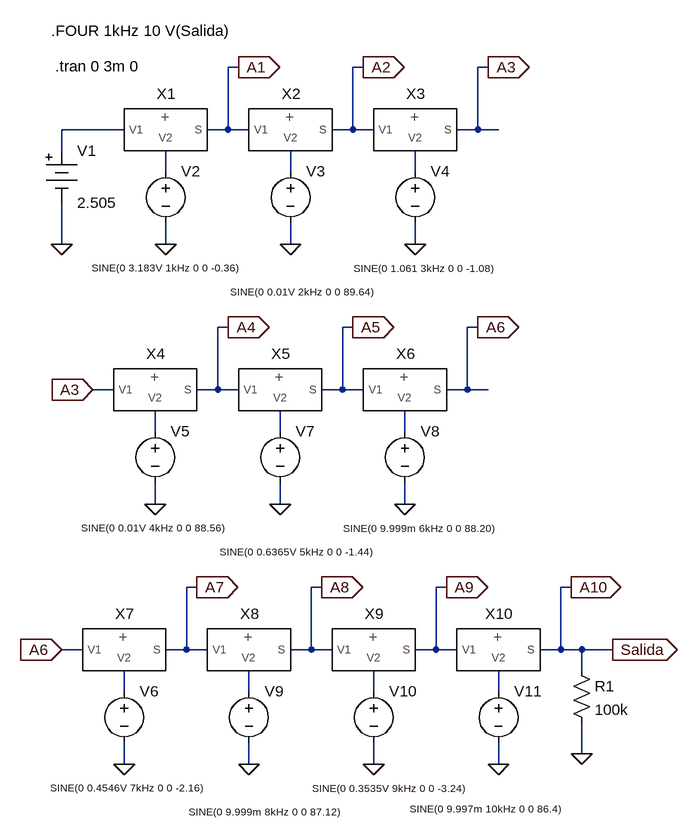
[diagram p0: schematic E5-Reconstruccion.asc]
E5-Reconstruccion.asc, the LTspice schematic file:
Version 4
SHEET 1 1008 680
WIRE -2576 -2576 -2592 -2576
WIRE -2384 -2576 -2400 -2576
WIRE -2192 -2576 -2208 -2576
WIRE -2752 -2480 -2848 -2480
WIRE -2592 -2480 -2592 -2576
WIRE -2592 -2480 -2624 -2480
WIRE -2560 -2480 -2592 -2480
WIRE -2400 -2480 -2400 -2576
WIRE -2400 -2480 -2432 -2480
WIRE -2368 -2480 -2400 -2480
WIRE -2208 -2480 -2208 -2576
WIRE -2208 -2480 -2240 -2480
WIRE -2176 -2480 -2208 -2480
WIRE -2848 -2448 -2848 -2480
WIRE -2688 -2416 -2688 -2448
WIRE -2496 -2416 -2496 -2448
WIRE -2304 -2416 -2304 -2448
WIRE -2848 -2304 -2848 -2368
WIRE -2688 -2304 -2688 -2336
WIRE -2496 -2304 -2496 -2336
WIRE -2304 -2304 -2304 -2336
WIRE -2592 -2176 -2608 -2176
WIRE -2400 -2176 -2416 -2176
WIRE -2208 -2176 -2224 -2176
WIRE -2768 -2080 -2800 -2080
WIRE -2608 -2080 -2608 -2176
WIRE -2608 -2080 -2640 -2080
WIRE -2576 -2080 -2608 -2080
WIRE -2416 -2080 -2416 -2176
WIRE -2416 -2080 -2448 -2080
WIRE -2384 -2080 -2416 -2080
WIRE -2224 -2080 -2224 -2176
WIRE -2224 -2080 -2256 -2080
WIRE -2192 -2080 -2224 -2080
WIRE -2704 -2016 -2704 -2048
WIRE -2512 -2016 -2512 -2048
WIRE -2320 -2016 -2320 -2048
WIRE -2704 -1904 -2704 -1936
WIRE -2512 -1904 -2512 -1936
WIRE -2320 -1904 -2320 -1936
WIRE -2640 -1776 -2656 -1776
WIRE -2448 -1776 -2464 -1776
WIRE -2256 -1776 -2272 -1776
WIRE -2064 -1776 -2080 -1776
WIRE -2816 -1680 -2848 -1680
WIRE -2656 -1680 -2656 -1776
WIRE -2656 -1680 -2688 -1680
WIRE -2624 -1680 -2656 -1680
WIRE -2464 -1680 -2464 -1776
WIRE -2464 -1680 -2496 -1680
WIRE -2432 -1680 -2464 -1680
WIRE -2272 -1680 -2272 -1776
WIRE -2272 -1680 -2304 -1680
WIRE -2240 -1680 -2272 -1680
WIRE -2080 -1680 -2080 -1776
WIRE -2080 -1680 -2112 -1680
WIRE -2048 -1680 -2080 -1680
WIRE -2000 -1680 -2048 -1680
WIRE -2048 -1648 -2048 -1680
WIRE -2752 -1616 -2752 -1648
WIRE -2560 -1616 -2560 -1648
WIRE -2368 -1616 -2368 -1648
WIRE -2176 -1616 -2176 -1648
WIRE -2048 -1520 -2048 -1568
WIRE -2752 -1504 -2752 -1536
WIRE -2560 -1504 -2560 -1536
WIRE -2368 -1504 -2368 -1536
WIRE -2176 -1504 -2176 -1536
FLAG -2848 -2304 0
FLAG -2688 -2304 0
FLAG -2496 -2304 0
FLAG -2304 -2304 0
FLAG -2576 -2576 A1
IOPIN -2576 -2576 Out
FLAG -2384 -2576 A2
IOPIN -2384 -2576 Out
FLAG -2192 -2576 A3
IOPIN -2192 -2576 Out
FLAG -2704 -1904 0
FLAG -2512 -1904 0
FLAG -2320 -1904 0
FLAG -2592 -2176 A4
IOPIN -2592 -2176 Out
FLAG -2400 -2176 A5
IOPIN -2400 -2176 Out
FLAG -2208 -2176 A6
IOPIN -2208 -2176 Out
FLAG -2800 -2080 A3
IOPIN -2800 -2080 In
FLAG -2048 -1520 0
FLAG -2752 -1504 0
FLAG -2560 -1504 0
FLAG -2368 -1504 0
FLAG -2640 -1776 A7
IOPIN -2640 -1776 Out
FLAG -2448 -1776 A8
IOPIN -2448 -1776 Out
FLAG -2256 -1776 A9
IOPIN -2256 -1776 Out
FLAG -2848 -1680 A6
IOPIN -2848 -1680 In
FLAG -2176 -1504 0
FLAG -2064 -1776 A10
IOPIN -2064 -1776 Out
FLAG -2000 -1680 Salida
IOPIN -2000 -1680 Out
SYMBOL voltage -2688 -2432 R0
WINDOW 3 -114 164 Left 1
WINDOW 123 0 0 Left 0
WINDOW 39 0 0 Left 0
SYMATTR Value SINE(0 3.183V 1kHz 0 0 -0.36)
SYMATTR InstName V2
SYMBOL Misc\\battery -2848 -2464 R0
SYMATTR InstName V1
SYMATTR Value 2.505
SYMBOL Mis_Componentes\\E7-sumador-analogico -2688 -2480 R0
SYMATTR InstName X1
SYMBOL Mis_Componentes\\E7-sumador-analogico -2496 -2480 R0
SYMATTR InstName X2
SYMBOL Mis_Componentes\\E7-sumador-analogico -2304 -2480 R0
SYMATTR InstName X3
SYMBOL voltage -2496 -2432 R0
WINDOW 3 -93 201 Left 1
WINDOW 123 0 0 Left 0
WINDOW 39 0 0 Left 0
SYMATTR Value SINE(0 0.01V 2kHz 0 0 89.64)
SYMATTR InstName V3
SYMBOL voltage -2304 -2432 R0
WINDOW 3 -95 165 Left 1
WINDOW 123 0 0 Left 0
WINDOW 39 0 0 Left 0
SYMATTR Value SINE(0 1.061 3kHz 0 0 -1.08)
SYMATTR InstName V4
SYMBOL res -2064 -1664 R0
SYMATTR InstName R1
SYMATTR Value 100k
SYMBOL voltage -2704 -2032 R0
WINDOW 3 -114 164 Left 1
WINDOW 123 0 0 Left 0
WINDOW 39 0 0 Left 0
SYMATTR Value SINE(0 0.01V 4kHz 0 0 88.56)
SYMATTR InstName V5
SYMBOL Mis_Componentes\\E7-sumador-analogico -2704 -2080 R0
SYMATTR InstName X4
SYMBOL Mis_Componentes\\E7-sumador-analogico -2512 -2080 R0
SYMATTR InstName X5
SYMBOL Mis_Componentes\\E7-sumador-analogico -2320 -2080 R0
SYMATTR InstName X6
SYMBOL voltage -2512 -2032 R0
WINDOW 3 -93 201 Left 1
WINDOW 123 0 0 Left 0
WINDOW 39 0 0 Left 0
SYMATTR Value SINE(0 0.6365V 5kHz 0 0 -1.44)
SYMATTR InstName V7
SYMBOL voltage -2320 -2032 R0
WINDOW 3 -95 165 Left 1
WINDOW 123 0 0 Left 0
WINDOW 39 0 0 Left 0
SYMATTR Value SINE(0 9.999m 6kHz 0 0 88.20)
SYMATTR InstName V8
SYMBOL voltage -2752 -1632 R0
WINDOW 3 -114 164 Left 1
WINDOW 123 0 0 Left 0
WINDOW 39 0 0 Left 0
SYMATTR Value SINE(0 0.4546V 7kHz 0 0 -2.16)
SYMATTR InstName V6
SYMBOL Mis_Componentes\\E7-sumador-analogico -2752 -1680 R0
SYMATTR InstName X7
SYMBOL Mis_Componentes\\E7-sumador-analogico -2560 -1680 R0
SYMATTR InstName X8
SYMBOL Mis_Componentes\\E7-sumador-analogico -2368 -1680 R0
SYMATTR InstName X9
SYMBOL voltage -2560 -1632 R0
WINDOW 3 -93 201 Left 1
WINDOW 123 0 0 Left 0
WINDOW 39 0 0 Left 0
SYMATTR Value SINE(0 9.999m 8kHz 0 0 87.12)
SYMATTR InstName V9
SYMBOL voltage -2368 -1632 R0
WINDOW 3 -95 165 Left 1
WINDOW 123 0 0 Left 0
WINDOW 39 0 0 Left 0
SYMATTR Value SINE(0 0.3535V 9kHz 0 0 -3.24)
SYMATTR InstName V10
SYMBOL Mis_Componentes\\E7-sumador-analogico -2176 -1680 R0
SYMATTR InstName X10
SYMBOL voltage -2176 -1632 R0
WINDOW 3 -137 197 Left 1
WINDOW 123 0 0 Left 0
WINDOW 39 0 0 Left 0
SYMATTR Value SINE(0 9.997m 10kHz 0 0 86.4)
SYMATTR InstName V11
TEXT -2858 -2578 Left 2 !.tran 0 3m 0
TEXT -2864 -2632 Left 2 !.FOUR 1kHz 10 V(Salida)

The netlist it stands for:
* E5-Reconstruccion.asc
V2 N002 0 SINE(0 3.183V 1kHz 0 0 -0.36)
V1 N001 0 2.505
XX1 N001 N002 A1 E7-sumador-analogico  ; pins V1 V2 S
XX2 A1 N003 A2 E7-sumador-analogico  ; pins V1 V2 S
XX3 A2 N004 A3 E7-sumador-analogico  ; pins V1 V2 S
V3 N003 0 SINE(0 0.01V 2kHz 0 0 89.64)
V4 N004 0 SINE(0 1.061 3kHz 0 0 -1.08)
R1 Salida 0 100k
V5 N005 0 SINE(0 0.01V 4kHz 0 0 88.56)
XX4 A3 N005 A4 E7-sumador-analogico  ; pins V1 V2 S
XX5 A4 N006 A5 E7-sumador-analogico  ; pins V1 V2 S
XX6 A5 N007 A6 E7-sumador-analogico  ; pins V1 V2 S
V7 N006 0 SINE(0 0.6365V 5kHz 0 0 -1.44)
V8 N007 0 SINE(0 9.999m 6kHz 0 0 88.20)
V6 N008 0 SINE(0 0.4546V 7kHz 0 0 -2.16)
XX7 A6 N008 A7 E7-sumador-analogico  ; pins V1 V2 S
XX8 A7 N009 A8 E7-sumador-analogico  ; pins V1 V2 S
XX9 A8 N010 A9 E7-sumador-analogico  ; pins V1 V2 S
V9 N009 0 SINE(0 9.999m 8kHz 0 0 87.12)
V10 N010 0 SINE(0 0.3535V 9kHz 0 0 -3.24)
XX10 A9 N011 Salida E7-sumador-analogico  ; pins V1 V2 S
V11 N011 0 SINE(0 9.997m 10kHz 0 0 86.4)
.tran 0 3m 0
.FOUR 1kHz 10 V(Salida)
.backanno
.end